# Altium schematic sheet 10_MISC.SchDoc
size A2; ApprovedBy: DNP; CheckedBy: DNP; Author: DNP; CompanyName: Google LLC; DrawnBy: DNP; Engineer: Bangfei/Michael/Leo; Organization: Google LLC; Address1: 1600 Amphitheatre Parkway; Address2: Mountain View, CA 94043; Address3: DNP; Address4: DNP; DocumentNumber: DNP; Revision: PVT; SheetNumber: 10; SheetTotal: 11; VersionControl_RevNumber: DNP; IsUserConfigurable: DNP; Time: DNP; ImagePath: DNP; Rule: DNP; ProjectName: Enterprise; Application_BuildNumber: DNP
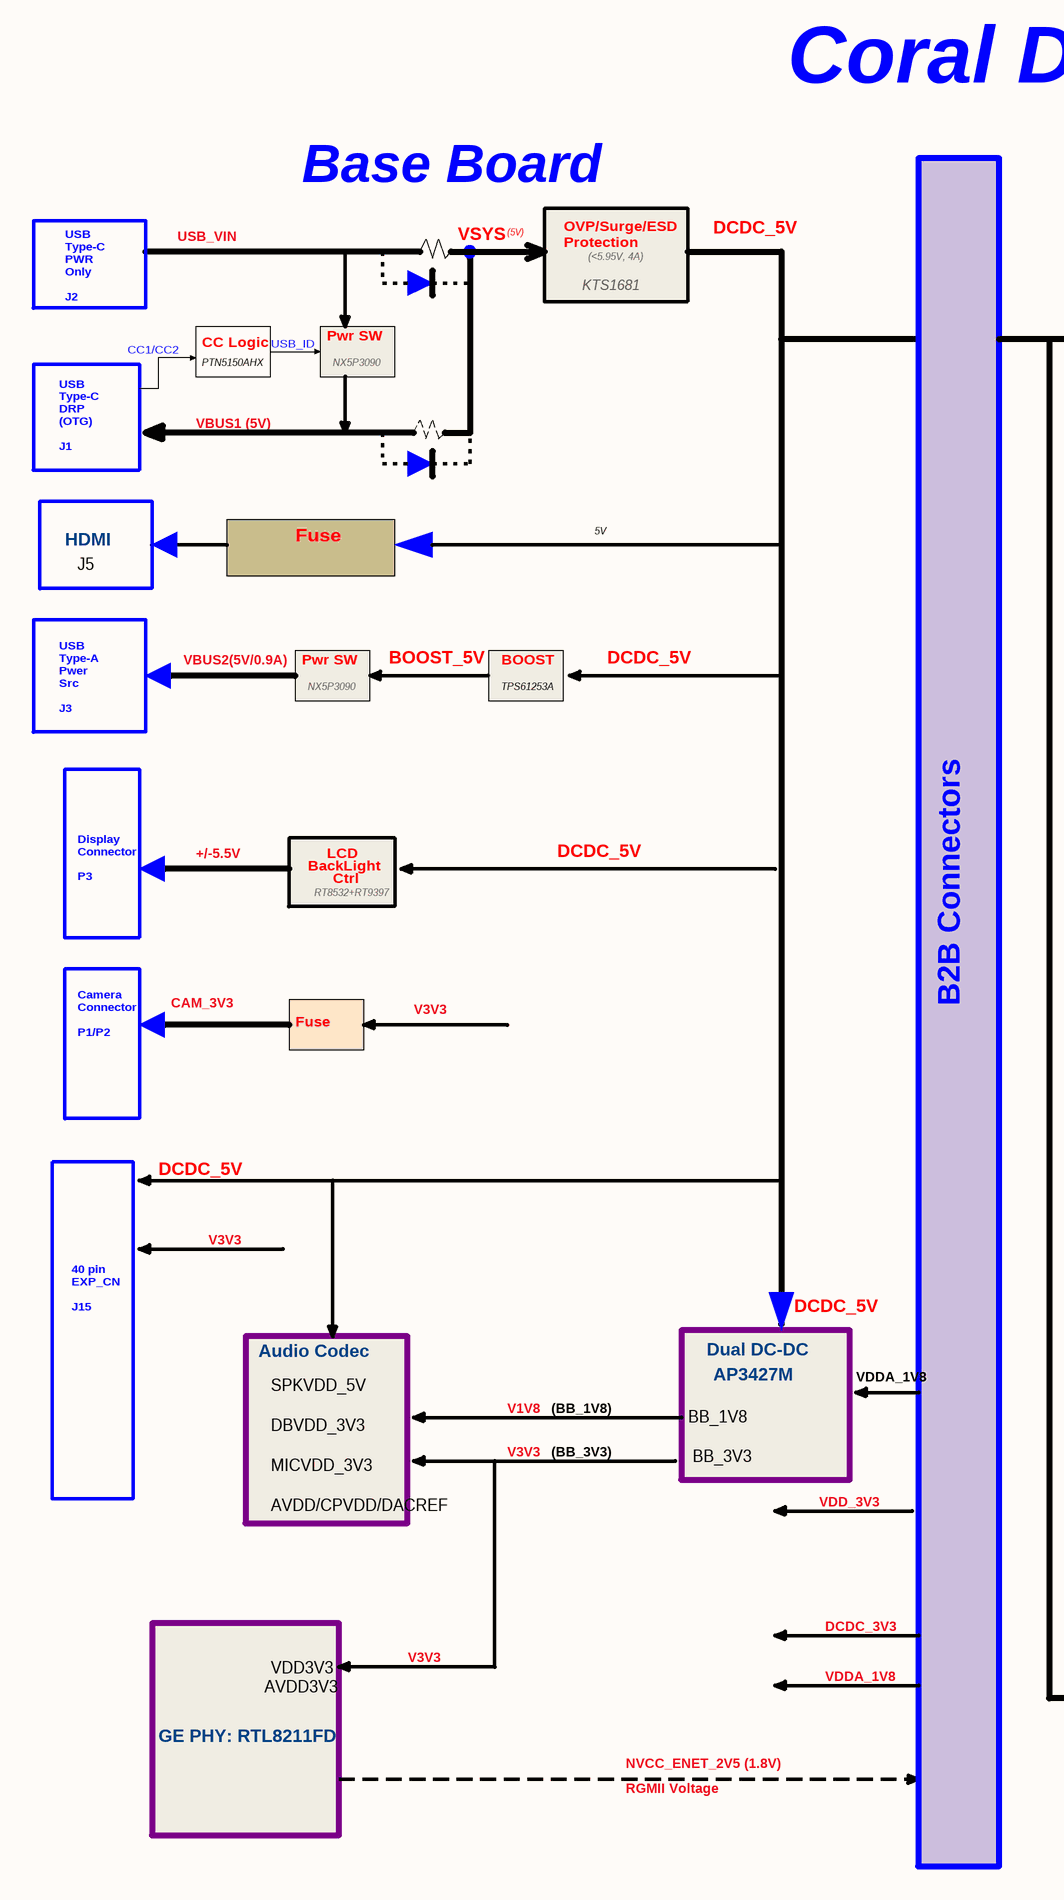
[diagram p0: 10_MISC.SchDoc, left]
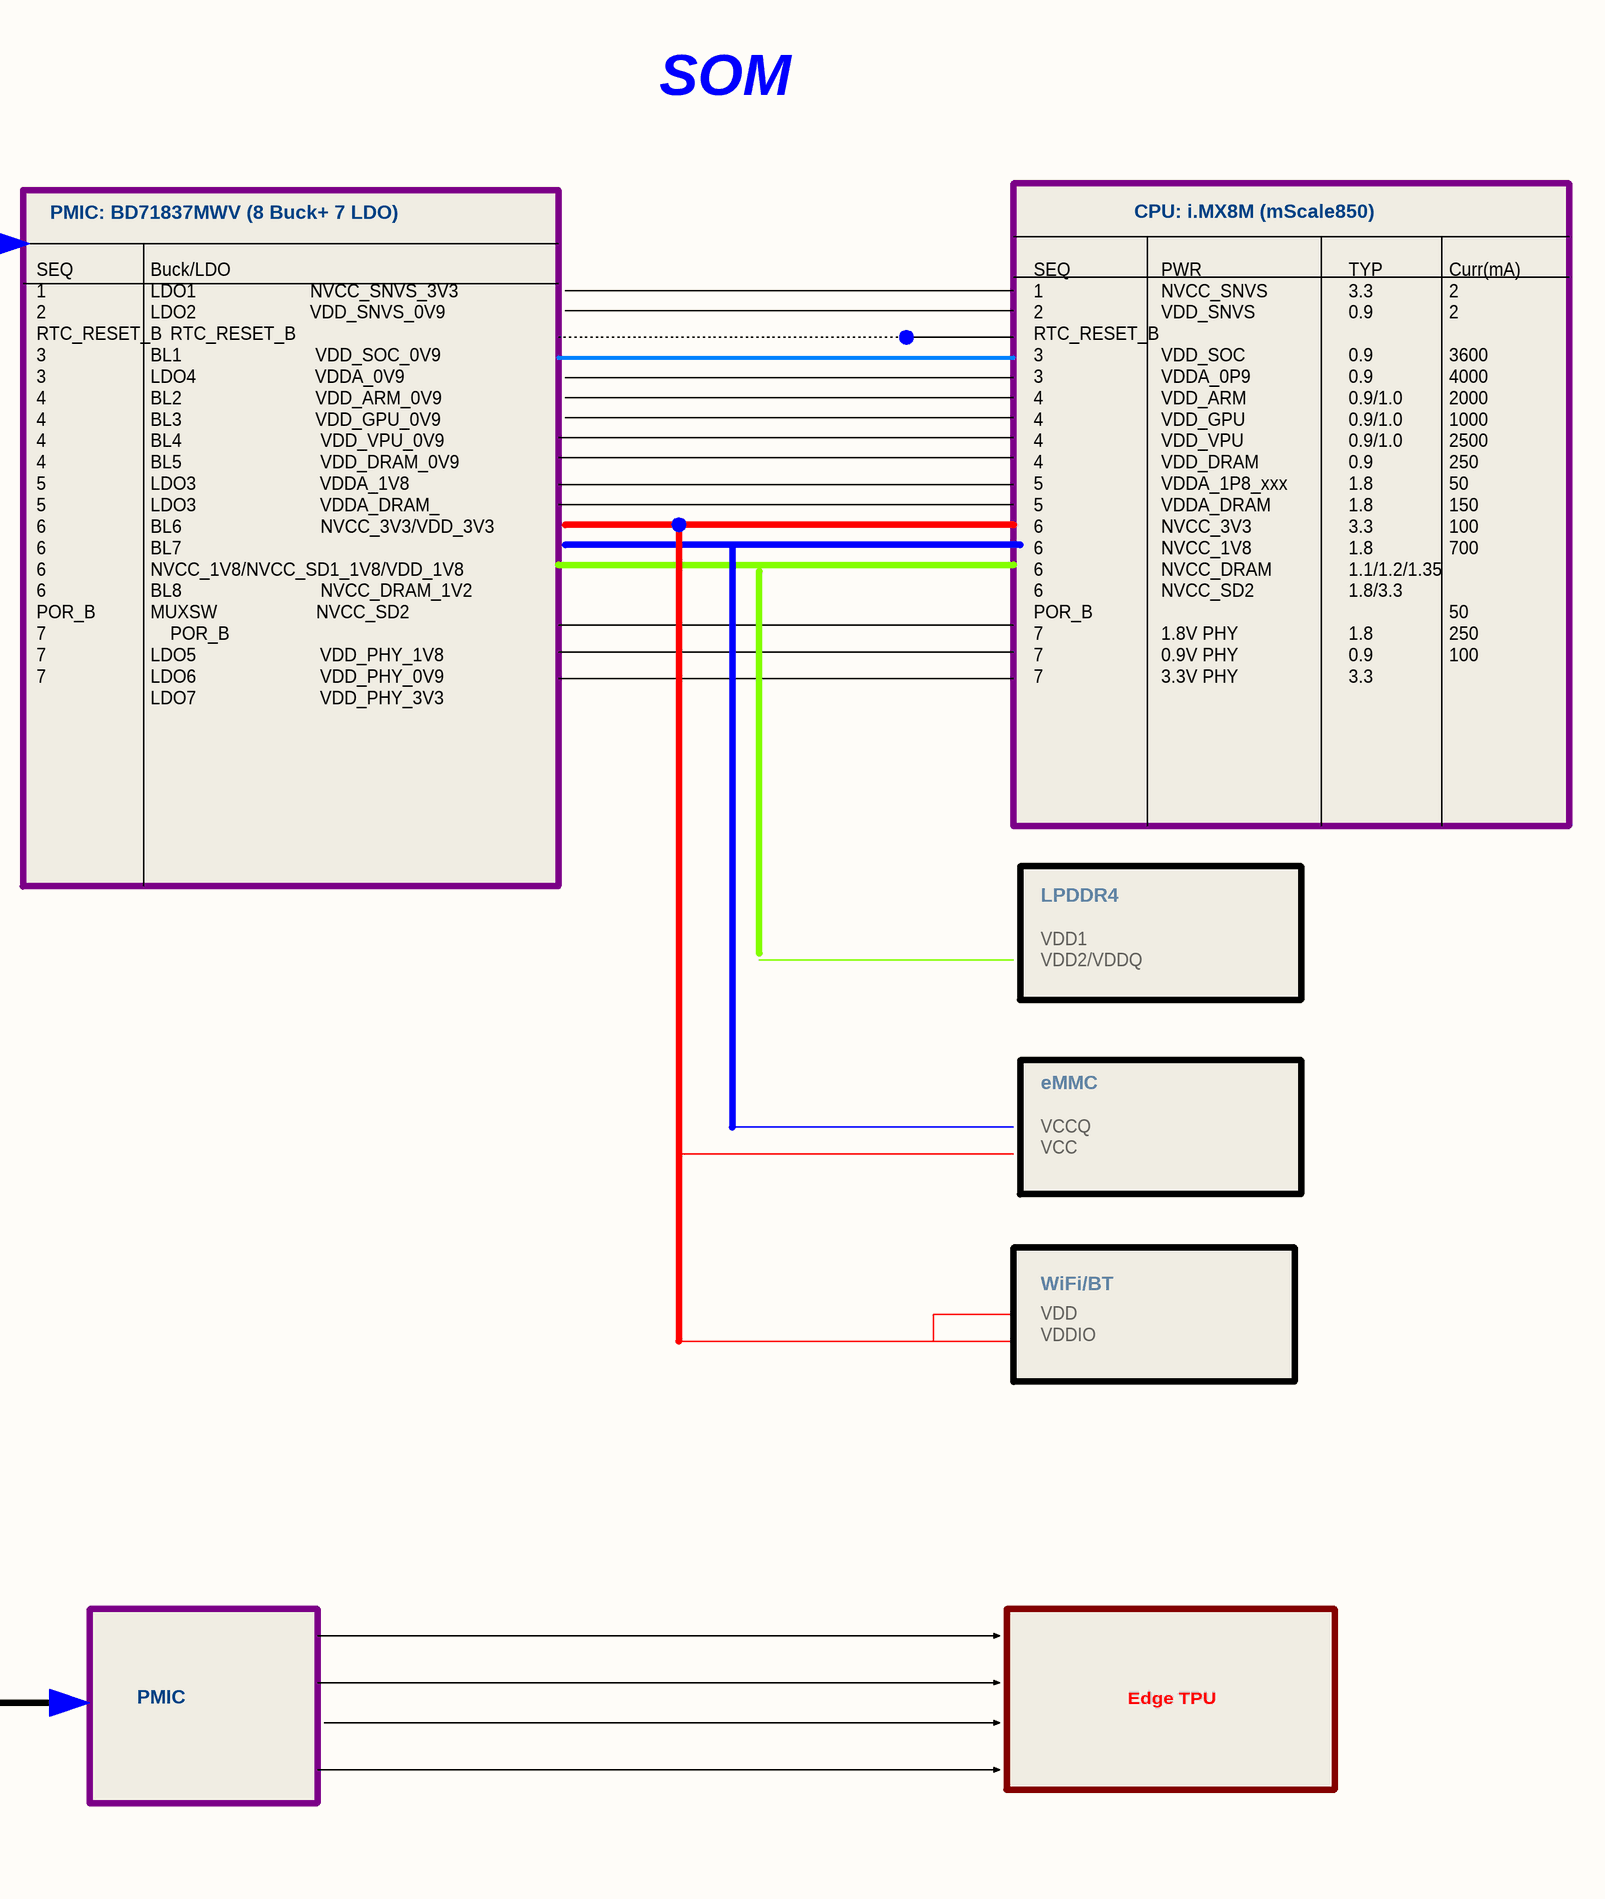
[diagram p1: 10_MISC.SchDoc, right]

## Notes on the sheet
- Coral Dev Board  Power Diagram
- Base Board
- SOM
- USB_VIN
- VSYS
- (5V)
- OVP/Surge/ESD
- Protection
- (<5.95V, 4A)
- DCDC_5V
- USB Type-C
  PWR Only
  J2
- CC1/CC2
- CC Logic
- USB_ID
- Pwr SW
- KTS1681
- PMIC: BD71837MWV (8 Buck+ 7 LDO)
- CPU: i.MX8M (mScale850)
- PTN5150AHX
- NX5P3090
- USB Type-C
  DRP (OTG)
  J1
- VBUS1 (5V)
- 5V
- HDMI
- J5
- Fuse
- USB Type-A
  Pwer Src
  J3
- VBUS2(5V/0.9A)
- BOOST_5V
- BOOST
- TPS61253A
- Display
  Connector
  P3
- +/-5.5V
- BackLight
- RT8532+RT9397
- LCD
- Ctrl
- SEQ
  1
  2
  RTC_RESET_B
  3
  3
  4
  4
  4
  4
  5
  5
  6
  6
  6
  6
  POR_B
  7
  7
  7
- Buck/LDO
  LDO1                       NVCC_SNVS_3V3
  LDO2                       VDD_SNVS_0V9
  RTC_RESET_B
  BL1                           VDD_SOC_0V9
  LDO4                        VDDA_0V9
  BL2                           VDD_ARM_0V9
  BL3                           VDD_GPU_0V9
  BL4                            VDD_VPU_0V9
  BL5                            VDD_DRAM_0V9
  LDO3                         VDDA_1V8
  LDO3                         VDDA_DRAM_
  BL6                            NVCC_3V3/VDD_3V3
  BL7                            NVCC_1V8/NVCC_SD1_1V8/VDD_1V8
  BL8                            NVCC_DRAM_1V2
  MUXSW                    NVCC_SD2
  POR_B
  LDO5                         VDD_PHY_1V8
  LDO6                         VDD_PHY_0V9
  LDO7                         VDD_PHY_3V3
- PWR
  NVCC_SNVS
  VDD_SNVS
  VDD_SOC
  VDDA_0P9
  VDD_ARM
  VDD_GPU
  VDD_VPU
  VDD_DRAM
  VDDA_1P8_xxx
  VDDA_DRAM
  NVCC_3V3
  NVCC_1V8
  NVCC_DRAM
  NVCC_SD2
  1.8V PHY
  0.9V PHY
  3.3V PHY
- TYP
  3.3
  0.9
  0.9
  0.9
  0.9/1.0
  0.9/1.0
  0.9/1.0
  0.9
  1.8
  1.8
  3.3
  1.8
  1.1/1.2/1.35
  1.8/3.3
  1.8
  0.9
  3.3
- Curr(mA)
  2
  2
  3600
  4000
  2000
  1000
  2500
  250
  50
  150
  100
  700
  50
  250
  100
- LPDDR4
- CAM_3V3
- V3V3
- B2B Connectors
- VDD1
  VDD2/VDDQ
- Camera
  Connector
  P1/P2
- eMMC
- VCCQ
  VCC
- 40 pin
  EXP_CN
  J15
- WiFi/BT
- Audio Codec
- Dual DC-DC
- AP3427M
- VDDA_1V8
- VDD
  VDDIO
- V1V8
- (BB_3V3)
- (BB_1V8)
- BB_1V8
  BB_3V3
- SPKVDD_5V
  DBVDD_3V3
  MICVDD_3V3
  AVDD/CPVDD/DACREF
- VDD_3V3
- DCDC_3V3
- AVDD3V3
- VDD3V3
- PMIC
- Edge TPU
- GE PHY: RTL8211FD
- NVCC_ENET_2V5 (1.8V)
- RGMII Voltage
- Project:
- Engineer:
- Date:
- File:
- Revision:
- Sheet
- of